# EAGLE design SolarWing (EAGLE 9.6.2)
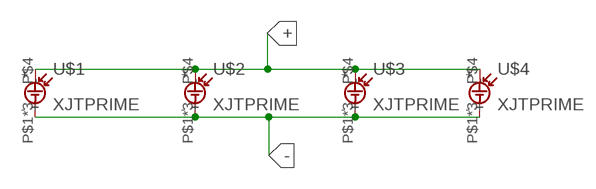
[diagram p0: schematic, sheet 1]

## Parts
U$1  XJTPRIME  [XJTPRIME]
U$2  XJTPRIME  [XJTPRIME]
U$3  XJTPRIME  [XJTPRIME]
U$4  XJTPRIME  [XJTPRIME]

## Nets
+: U$1.P$4(+) U$2.P$4(+) U$3.P$4(+) U$4.P$4(+)
-: U$1.P$1(-) U$1.P$2(-) U$1.P$3(-) U$2.P$1(-) U$2.P$2(-) U$2.P$3(-) U$3.P$1(-) U$3.P$2(-) U$3.P$3(-) U$4.P$1(-) U$4.P$2(-) U$4.P$3(-)

## Library data of the parts
U$1-U$4 = Solar:XJTPRIME: https://www.spectrolab.com/photovoltaics/XTJ-Prime_Data_Sheet.pdf

## Board
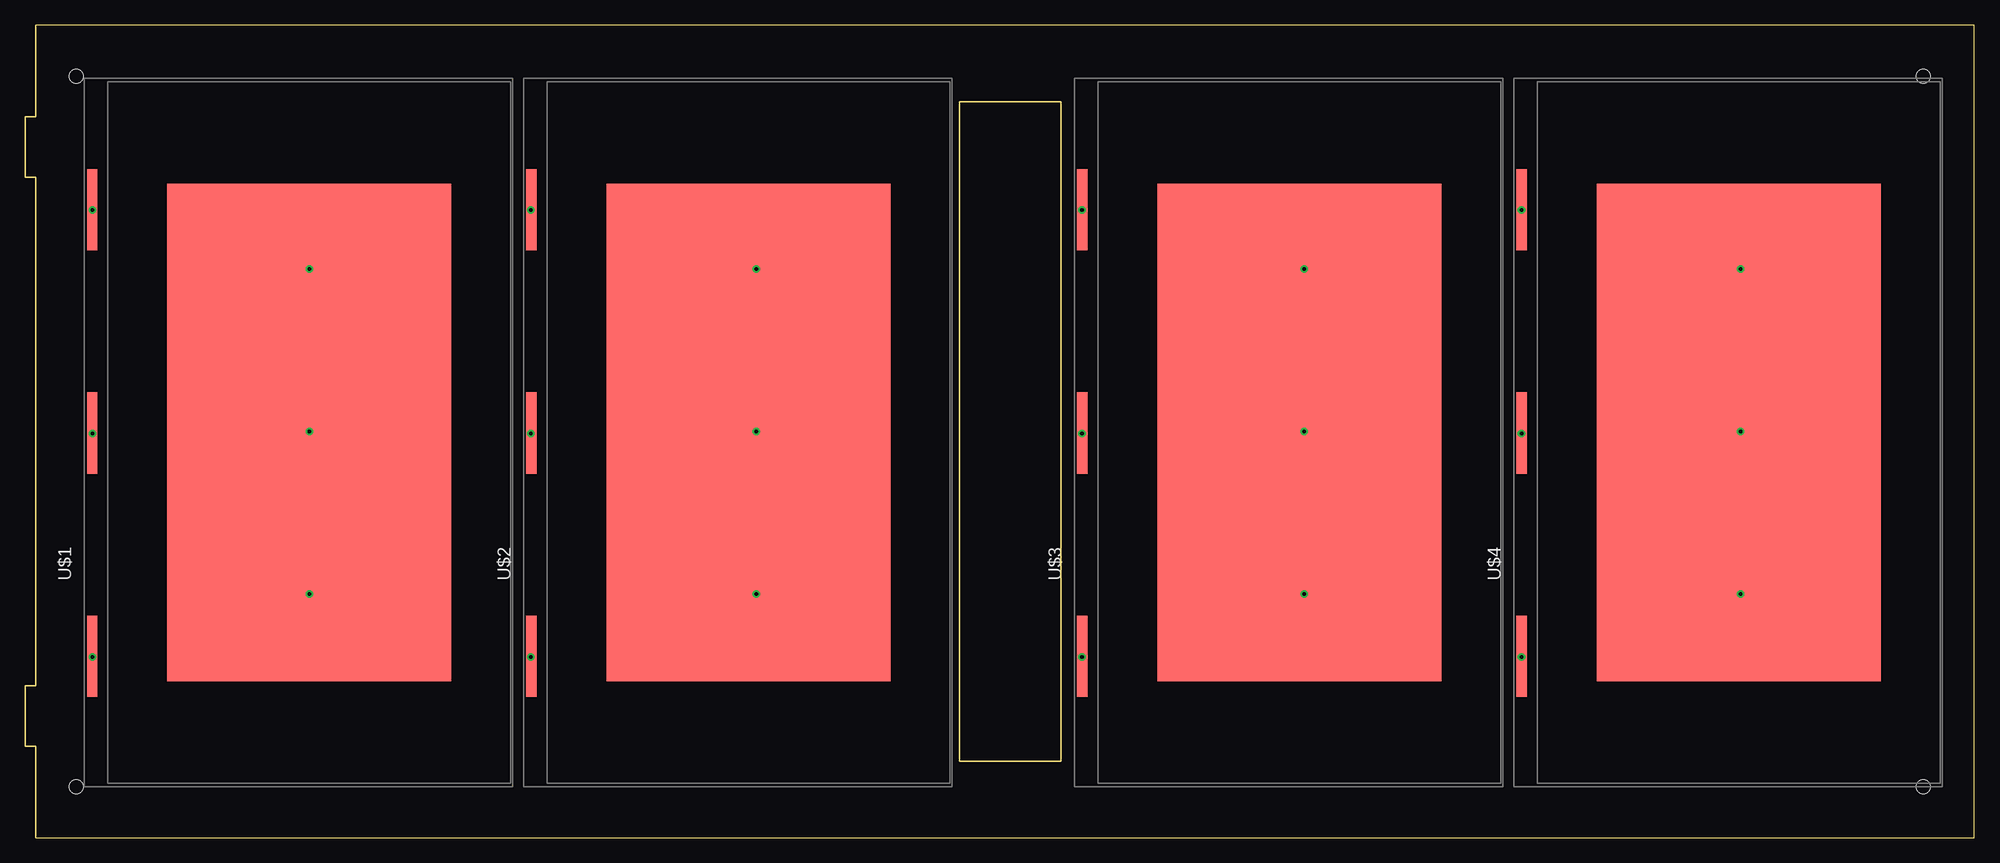
[diagram p1: board, top side]
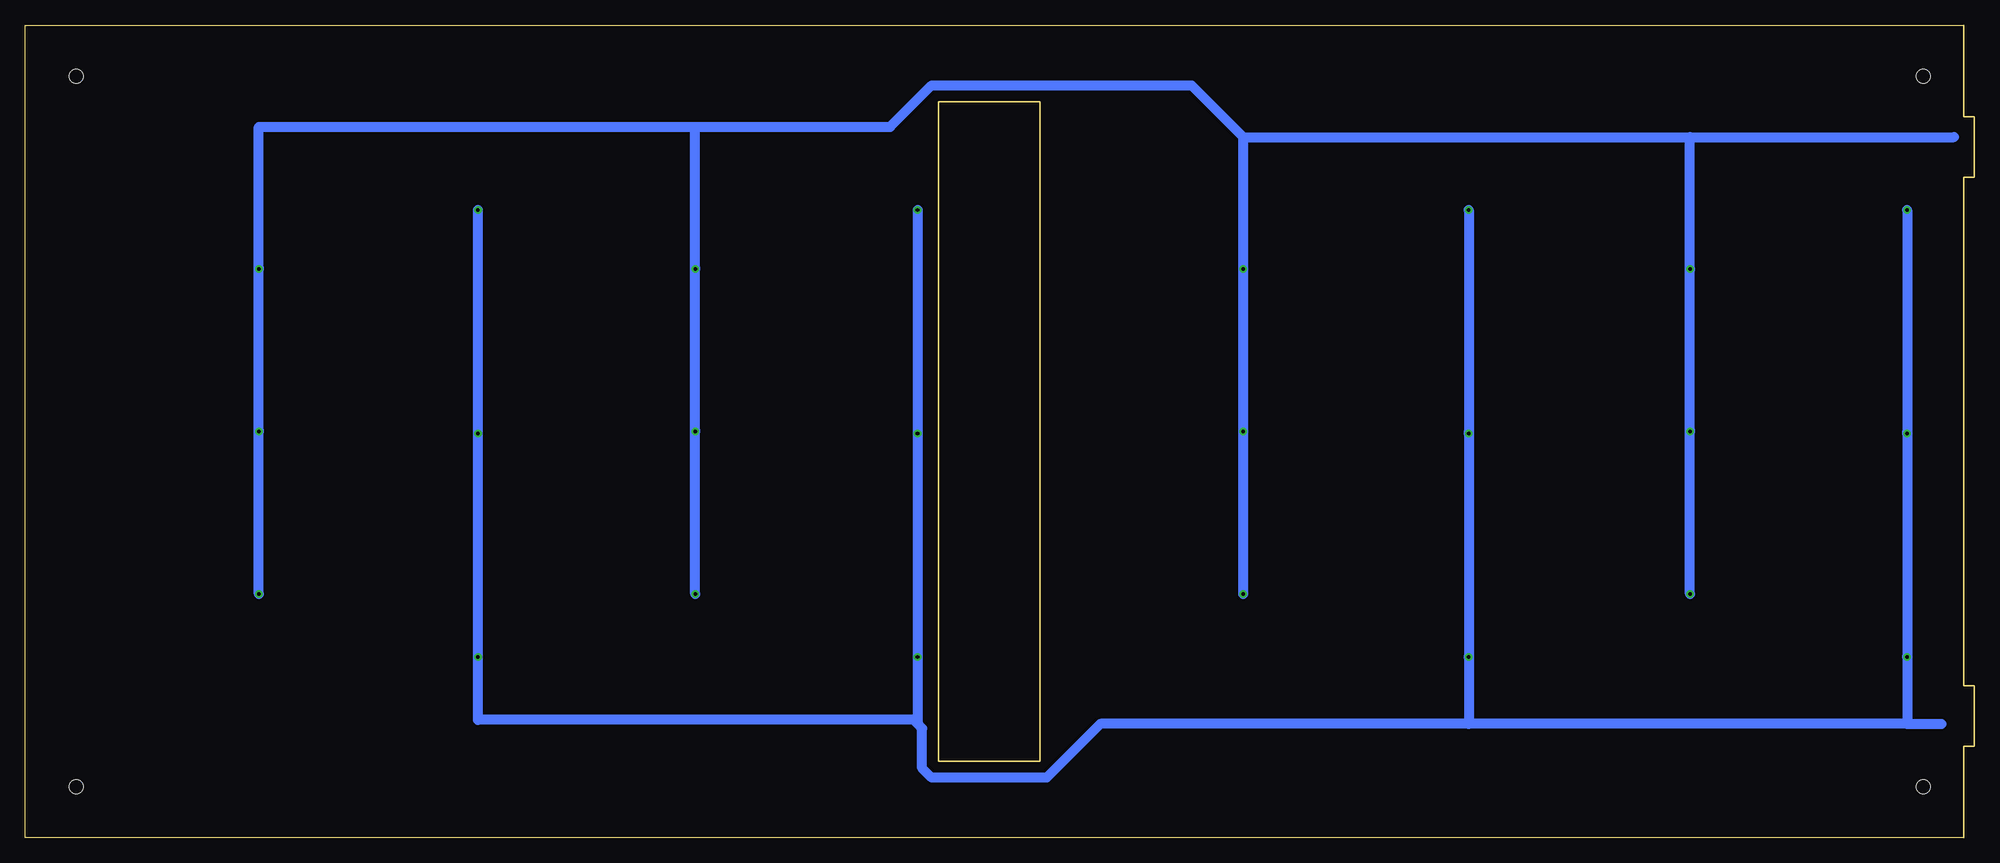
[diagram p2: board, bottom side, seen from below]

Size 192 x 80 mm. Coordinates in mm from the lower left corner, seen from the top.
Outline: 1,0 192,0 192,80 1,80 1,71 0,71 0,65.05 1,65.05 1,14.95 0,14.95 0,9 1,9 1,0
Outline: 102.05,72.5 92.05,72.5 92.05,7.5 102.05,7.5 102.05,72.5
Copper layers (1*16): Top 0.035mm / dielectric 1.5mm / Bottom 0.035mm
Design rules "default *": minimum track width 6mil, minimum drill 0.35mm, track to track 6mil, track to pad 6mil, pad to pad 6mil, via to via 6mil, smd to smd 6mil, copper to edge 40mil, drill to drill 6mil, minimum pad ring 10mil, minimum via ring 8mil, stop-mask expansion 4mil, vias tented up to drill 0mil, thermal gap 10mil
Holes 1.4 mm at 5,5 187,5 187,75 5,75

### Footprints (pad centres in the part's own frame; a part is rotated, then mirrored left to right if it is on the bottom)
XJTPRIME = smd 8 x 1: P$1 12.85,-0.75; P$2 34.85,-0.75; P$3 56.85,-0.75 | smd 49 x 28: P$4 34.9,-22.15

### Placement (x,y rotation side)
U$1  5.82,5 90 top
U$2  49.1,5 90 top
U$3  103.38,5 90 top
U$4  146.66,5 90 top

### Tracks (layer width: path | path; a pad name or v marks a point on that pad's centre or on a via)
+  (via drill 0.35)
  Top 0.152: U$1.P$4 28.04,39.93 v28,40 | U$2.P$4 71.32,39.93 71.93,39.93 v72,40 | U$3.P$4 125.58,39.93 125.88,39.93 v126,40 | U$4.P$4 168.86,39.93 v169,40
  Bottom 0.152: v28,40 28.04,40.08 28,40.08 | 28,55.93 28.04,55.93 v28,56 | v72,40 71.93,40.08 72,40.08 | v72,56 71.93,56.08 72,56.08 | v126,40 126.03,40.08 126,40.08 | v126,56 126.03,56.08 126,56.08 | v169,40 169.01,40.08 169,40.08 | v169,56 169.01,56.08 169,56.08
  Bottom 1: v28,24 v28,40 28,40.08 28,55.93 v28,56 28,69 | 28,69 2,69 | v72,24 v72,40 72,40.08 v72,56 72,56.08 72,69 | 72,69 28,69 | v126,24 v126,40 126,40.08 v126,56 126,56.08 126,70 | 126,70 106.8,70 102.71,74.09 77.09,74.09 72,69 | v169,24 v169,40 169,40.08 v169,56 169,56.08 169,70 126,70
-  (via drill 0.35)
  Top 0.152: v147.4,39.8 147.37,39.93 U$4.P$2 | v147.4,17.8 147.37,17.83 U$4.P$1 | v104.1,39.8 104.09,39.93 U$3.P$2 | v104.1,17.8 104.09,17.83 U$3.P$1 | v49.8,39.8 49.84,39.93 U$2.P$2 | v49.8,17.8 49.84,17.83 U$2.P$1 | v6.6,39.8 6.55,39.93 U$1.P$2 | v6.6,17.8 6.55,17.83 U$1.P$1 | v6.6,61.8 6.55,61.87 U$1.P$3 | U$2.P$3 49.84,61.87 v49.8,61.8 | U$3.P$3 104.09,61.87 v104.1,61.8 | U$4.P$3 147.37,61.87 v147.4,61.8
  Bottom 0.152: v6.6,17.8 6.55,17.83 6.6,17.83 | v6.6,39.8 6.55,39.93 6.6,39.93 | v49.8,17.8 49.84,17.83 49.8,17.83 | v49.8,39.8 49.84,39.93 49.8,39.93 | v104.1,17.8 104.09,17.83 104.1,17.83 | v104.1,39.8 104.09,39.93 104.1,39.93 | v147.4,17.8 147.37,17.83 147.4,17.83 | v147.4,39.8 147.37,39.93 147.4,39.93
  Bottom 1: v6.6,61.8 6.6,39.93 v6.6,39.8 6.6,17.83 v6.6,17.8 6.6,11.2 | 6.6,11.2 3.2,11.2 | 6.6,11.2 49.8,11.2 | 49.8,11.2 86.1,11.2 91.39,5.91 102.71,5.91 103.64,6.84 103.64,10.74 104.1,11.2 | v147.4,61.8 147.4,39.93 v147.4,39.8 147.4,17.83 v147.4,17.8 147.4,11.6 104.5,11.6 104.1,11.2 | v104.1,61.8 104.1,39.93 v104.1,39.8 104.1,17.83 v104.1,17.8 104.1,11.2 | v49.8,61.8 49.8,39.93 v49.8,39.8 49.8,17.83 v49.8,17.8 49.8,11.2